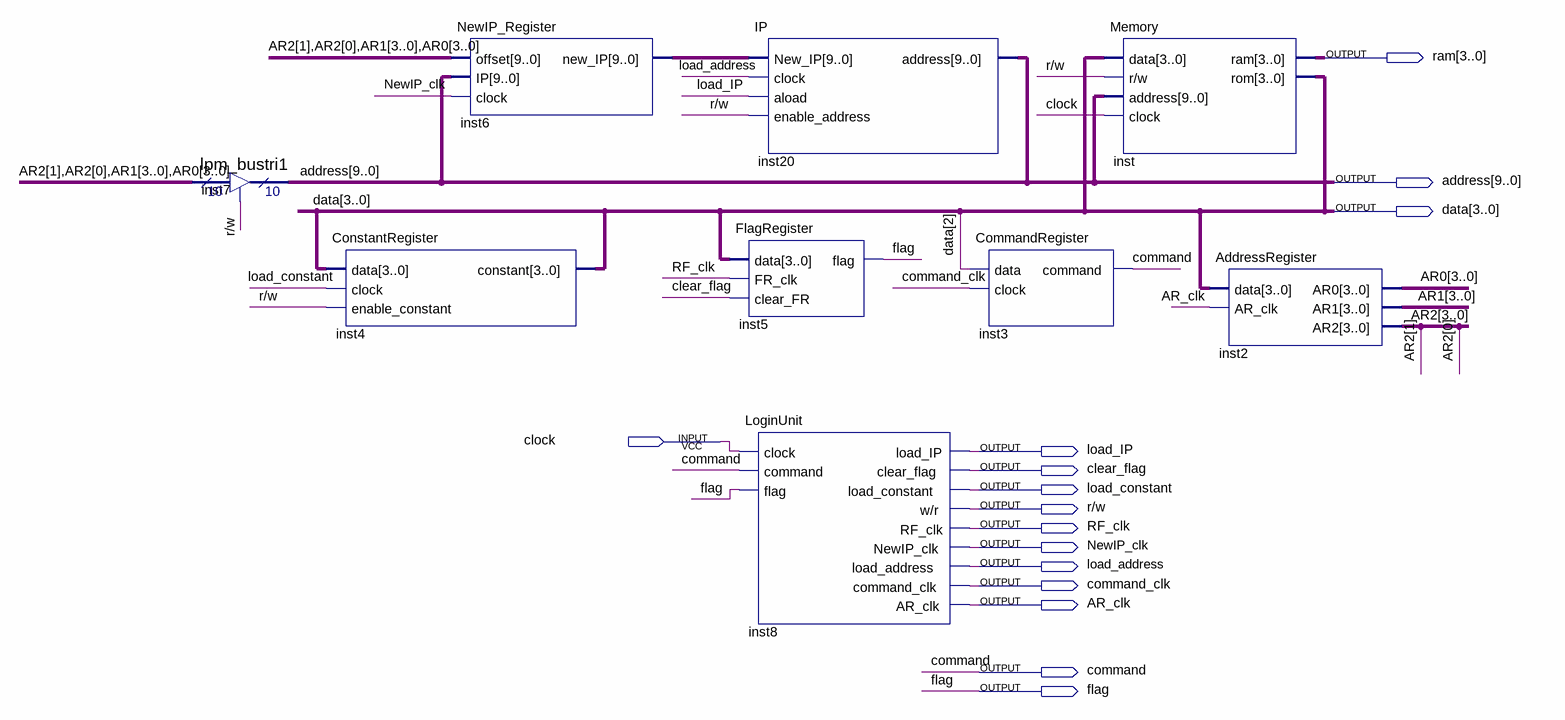
[diagram p0: schematic sheet]
// Quartus schematic Main.bdf as structural Verilog: 9 symbols, 15 pins
module Main (
  input  clock,
  output [3:0] ram,
  output [9:0] address,
  output [3:0] data,
  output load_IP,
  output clear_flag,
  output load_constant,
  output \r/w ,
  output RF_clk,
  output NewIP_clk,
  output load_address,
  output command_clk,
  output AR_clk,
  output command,
  output flag
);

  wire [3:0] AR0, AR1, AR2;
  wire [9:0] inst6_new_ip;

  lpm_bustri1 inst7 (.enabledt(\r/w ), .data({AR2[1:0], AR1, AR0}), .tridata(address));
  ConstantRegister inst4 (.data(data), .clock(load_constant), .enable_constant(\r/w ), .constant(data));
  NewIP_Register inst6 (.offset({AR2[1:0], AR1, AR0}), .IP(address), .clock(NewIP_clk), .new_IP(inst6_new_ip));
  IP inst20 (.New_IP(inst6_new_ip), .clock(load_address), .aload(load_IP), .enable_address(\r/w ), .address(address));
  FlagRegister inst5 (.data(data), .FR_clk(RF_clk), .clear_FR(clear_flag), .flag(flag));
  LoginUnit inst8 (
    .clock(clock), .command(command), .flag(flag), .load_IP(load_IP), .clear_flag(clear_flag),
    .load_constant(load_constant), .\w/r (\r/w ), .RF_clk(RF_clk), .NewIP_clk(NewIP_clk),
    .load_address(load_address), .command_clk(command_clk), .AR_clk(AR_clk));
  CommandRegister inst3 (.data(data[2]), .clock(command_clk), .command(command));
  Memory inst (.data(data), .\r/w (\r/w ), .address(address), .clock(clock), .ram(ram), .rom(data));
  AddressRegister inst2 (.data(data), .AR_clk(AR_clk), .AR0(AR0), .AR1(AR1), .AR2(AR2));
endmodule
